# EAGLE design at88g.v2 (EAGLE 4.16)
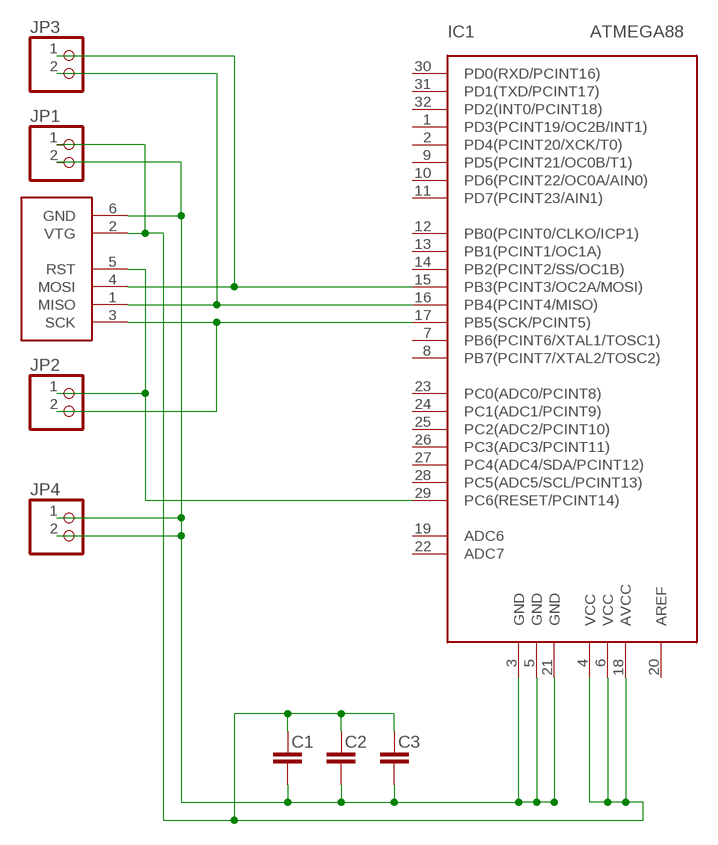
[diagram p0: schematic, sheet 1]

## Parts
C1  C-EU  [C0603]
C2  C-EU  [C0603]
C3  C-EU  [C0603]
IC1  ATMEGA88  [TQFP32]
JP1  PINHD-1X2  [1X02]
JP2  PINHD-1X2  [1X02]
JP3  PINHD-1X2  [1X02]
JP4  PINHD-1X2  [1X02]
X1  AVRISP6PIN  [6PIN]

## Nets
GND: C1.2 C2.2 C3.2 IC1.3(GND) IC1.5(GND) IC1.21(GND) JP1.2 JP4.1 JP4.2 X1.6(GND)
MISO: IC1.16(PB4(PCINT4/MISO)) JP3.2 X1.1(MISO)
MOSI: IC1.15(PB3(PCINT3/OC2A/MOSI)) JP3.1 X1.4(MOSI)
RST: IC1.29(PC6(RESET/PCINT14)) JP2.1 X1.5(RST)
SCK: IC1.17(PB5(SCK/PCINT5)) JP2.2 X1.3(SCK)
VCC: C1.1 C2.1 C3.1 IC1.4(VCC) IC1.6(VCC) IC1.18(AVCC) JP1.1 X1.2(VTG)
Unconnected: IC1.1(PD3(PCINT19/OC2B/INT1)) IC1.2(PD4(PCINT20/XCK/T0)) IC1.7(PB6(PCINT6/XTAL1/TOSC1)) IC1.8(PB7(PCINT7/XTAL2/TOSC2)) IC1.9(PD5(PCINT21/OC0B/T1)) IC1.10(PD6(PCINT22/OC0A/AIN0)) IC1.11(PD7(PCINT23/AIN1)) IC1.12(PB0(PCINT0/CLKO/ICP1)) IC1.13(PB1(PCINT1/OC1A)) IC1.14(PB2(PCINT2/SS/OC1B)) IC1.19(ADC6) IC1.20(AREF) IC1.22(ADC7) IC1.23(PC0(ADC0/PCINT8)) IC1.24(PC1(ADC1/PCINT9)) IC1.25(PC2(ADC2/PCINT10)) IC1.26(PC3(ADC3/PCINT11)) IC1.27(PC4(ADC4/SDA/PCINT12)) IC1.28(PC5(ADC5/SCL/PCINT13)) IC1.30(PD0(RXD/PCINT16)) IC1.31(PD1(TXD/PCINT17)) IC1.32(PD2(INT0/PCINT18))

## Library data of the parts
C1-C3 = rcl:C-EU
IC1 = atmega88:ATMEGA88
JP1-JP4 = pinhead-mm:PINHD-1X2: PIN HEADER
X1 = avrisp:AVRISP6PIN

## Board
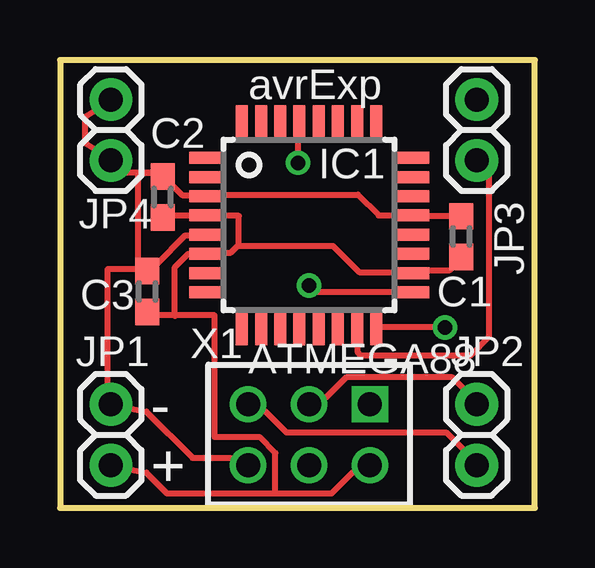
[diagram p1: board, top side]
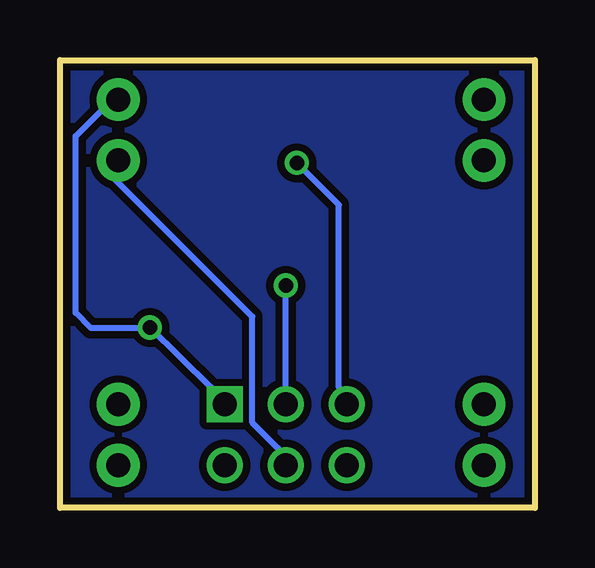
[diagram p2: board, bottom side, seen from below]

Size 19.79 x 18.66 mm. Coordinates in mm from the lower left corner, seen from the top.
Outline: 0,0 19.79,0 19.79,18.66 0,18.66 0,0
Copper layers (1*16): Top 0.035mm / dielectric 1.5mm / Bottom 0.035mm
Design rules "default": minimum track width 10mil, minimum drill 0.6mm, track to track 10mil, track to pad 10mil, pad to pad 10mil, via to via 10mil, smd to smd 10mil, copper to edge 10mil, drill to drill 10mil, minimum pad ring 10mil, minimum via ring 8mil, stop-mask expansion 4mil, vias tented up to drill 0mil, thermal gap 10mil

### Footprints (pad centres in the part's own frame; a part is rotated, then mirrored left to right if it is on the bottom)
C0603 = smd 1.1 x 1: 1 -0.85,0; 2 0.85,0
TQFP32 = smd 1.5 x 0.5: 1 -4.25,2.65; 2 -4.25,1.85; 3 -4.25,1.05; 4 -4.25,0.25; 5 -4.25,-0.55; 6 -4.25,-1.35; 7 -4.25,-2.15; 8 -4.25,-2.95; 17 4.25,-2.95; 18 4.25,-2.15; 19 4.25,-1.35; 20 4.25,-0.55; 21 4.25,0.25; 22 4.25,1.05; 23 4.25,1.85; 24 4.25,2.65 | smd 0.5 x 1.5: 9 -2.8,-4.4; 10 -2,-4.4; 11 -1.2,-4.4; 12 -0.4,-4.4; 13 0.4,-4.4; 14 1.2,-4.4; 15 2,-4.4; 16 2.8,-4.4; 25 2.8,4.1; 26 2,4.1; 27 1.2,4.1; 28 0.4,4.1; 29 -0.4,4.1; 30 -1.2,4.1; 31 -2,4.1; 32 -2.8,4.1
1X02 = drill 1 pad 1.778 round: 1 -1.27,0; 2 1.27,0
6PIN = drill 1 square: 1 -1.27,2.54 | drill 1 round: 2 1.27,2.54; 3 -1.27,0; 4 1.27,0; 5 -1.27,-2.54; 6 1.27,-2.54

### Placement (x,y rotation side)
C1  16.73,11.3 90 top
C2  4.28,12.95 90 top
C3  3.65,9.01 90 top
IC1  10.38,11.93 0 top
JP1  2.12,3.04 90 top
JP2  17.36,3.04 90 top
JP3  17.36,15.74 90 top
JP4  2.12,15.74 90 top
X1  10.38,3.04 270 top

### Tracks (layer width: path | path; a pad name or v marks a point on that pad's centre or on a via)
GND
  Top 0.254: X1.6 7.1,2.08 5.53,2.08 3.59,4.01 JP1.2 1.99,5.02 1.99,9.95 3.54,9.95 C3.2 | JP4.2 1.05,16.3 1.05,15.18 JP4.1 2.64,13.96 4.41,13.96 | IC1.5 5.73,11.35 5.22,11.35 4,10.13 C3.2 | C1.2 16.37,12.16 15.15,12.16 IC1.21 14.26,12.19 13.27,12.19 12.41,13.05 6.24,13.05 IC1.3 5.73,13.02 5.09,13.02 4.41,13.71 4.28,13.71 4.28,13.96 | 4.41,13.96 C2.2 | C3.2 3.56,10.24 3.26,10.28 3.26,13.97 4.28,13.96 | 4.41,13.96 4.41,13.97 | 4.41,13.96 | 4.28,13.96 4.41,13.96
GND0
  pour Bottom (isolate 0.305): 0.09,18.66 19.77,18.66 19.77,-0.01 0.09,-0.01
MISO  (via drill 0.6)
  Top 0.254: IC1.16 13.3,7.51 v16.04,7.51 16.07,7.49
  Bottom 0.254: X1.1 13.5,5.02 v16.04,7.51 15.99,7.51 15.96,7.49 18.5,7.49 19.14,8.12 19.14,15.49 17.61,17.01 JP3.2
MOSI
  Top 0.254: JP3.1 17.87,13.89 17.87,7.11 17.11,6.34 12.54,6.34 12.41,6.47 12.41,7.5 IC1.15
  Bottom 0.254: X1.4 10.71,2.48 11.77,3.55 11.77,7.97 17.56,13.76 JP3.1
RST  (via drill 0.6)
  Top 0.254: v9.92,14.37 9.92,15.77 IC1.29 | JP2.1 17.16,2.08 16.09,3.14 9.44,3.14 8.57,4.01 X1.5
  Bottom 0.254: v9.92,14.37 8.17,12.62 8.17,5.02 X1.5
SCK  (via drill 0.6)
  Top 0.254: JP2.2 17.16,4.62 16.32,5.46 11.95,5.46 11.11,4.62 X1.3 | IC1.17 14.6,9.01 10.5,9.01 10.25,9.27 v10.38,9.27
  Bottom 0.254: X1.3 v10.38,9.27
VCC
  Top 0.254: C1.1 16.24,9.9 15.02,9.9 IC1.18 14.26,9.83 12.46,9.83 11.37,10.92 7.46,10.92 7.43,10.94 | 7.43,10.94 7.46,10.97 7.46,12.16 6.49,12.16 IC1.4 5.73,12.16 4.51,12.16 C2.1 | 7.43,10.94 7.12,10.64 6.49,10.64 IC1.6 5.34,10.58 4.79,10.03 4.79,8.02 | 8.98,0.6 11.32,0.6 12.18,1.47 X1.2 | 8.98,0.6 4.46,0.6 3.59,1.47 JP1.1 | 4.79,8.02 6.44,8.02 6.44,2.94 8.32,2.94 8.98,2.28 8.98,0.6 | 4.79,8.02 4.79,8 | C3.1 3.56,8.16 3.52,8.12 3.62,8.02 4.79,8.02

### Text on the board
tPlace: avrExp | - | +